# EAGLE design ardusb_zif (EAGLE 6.4)
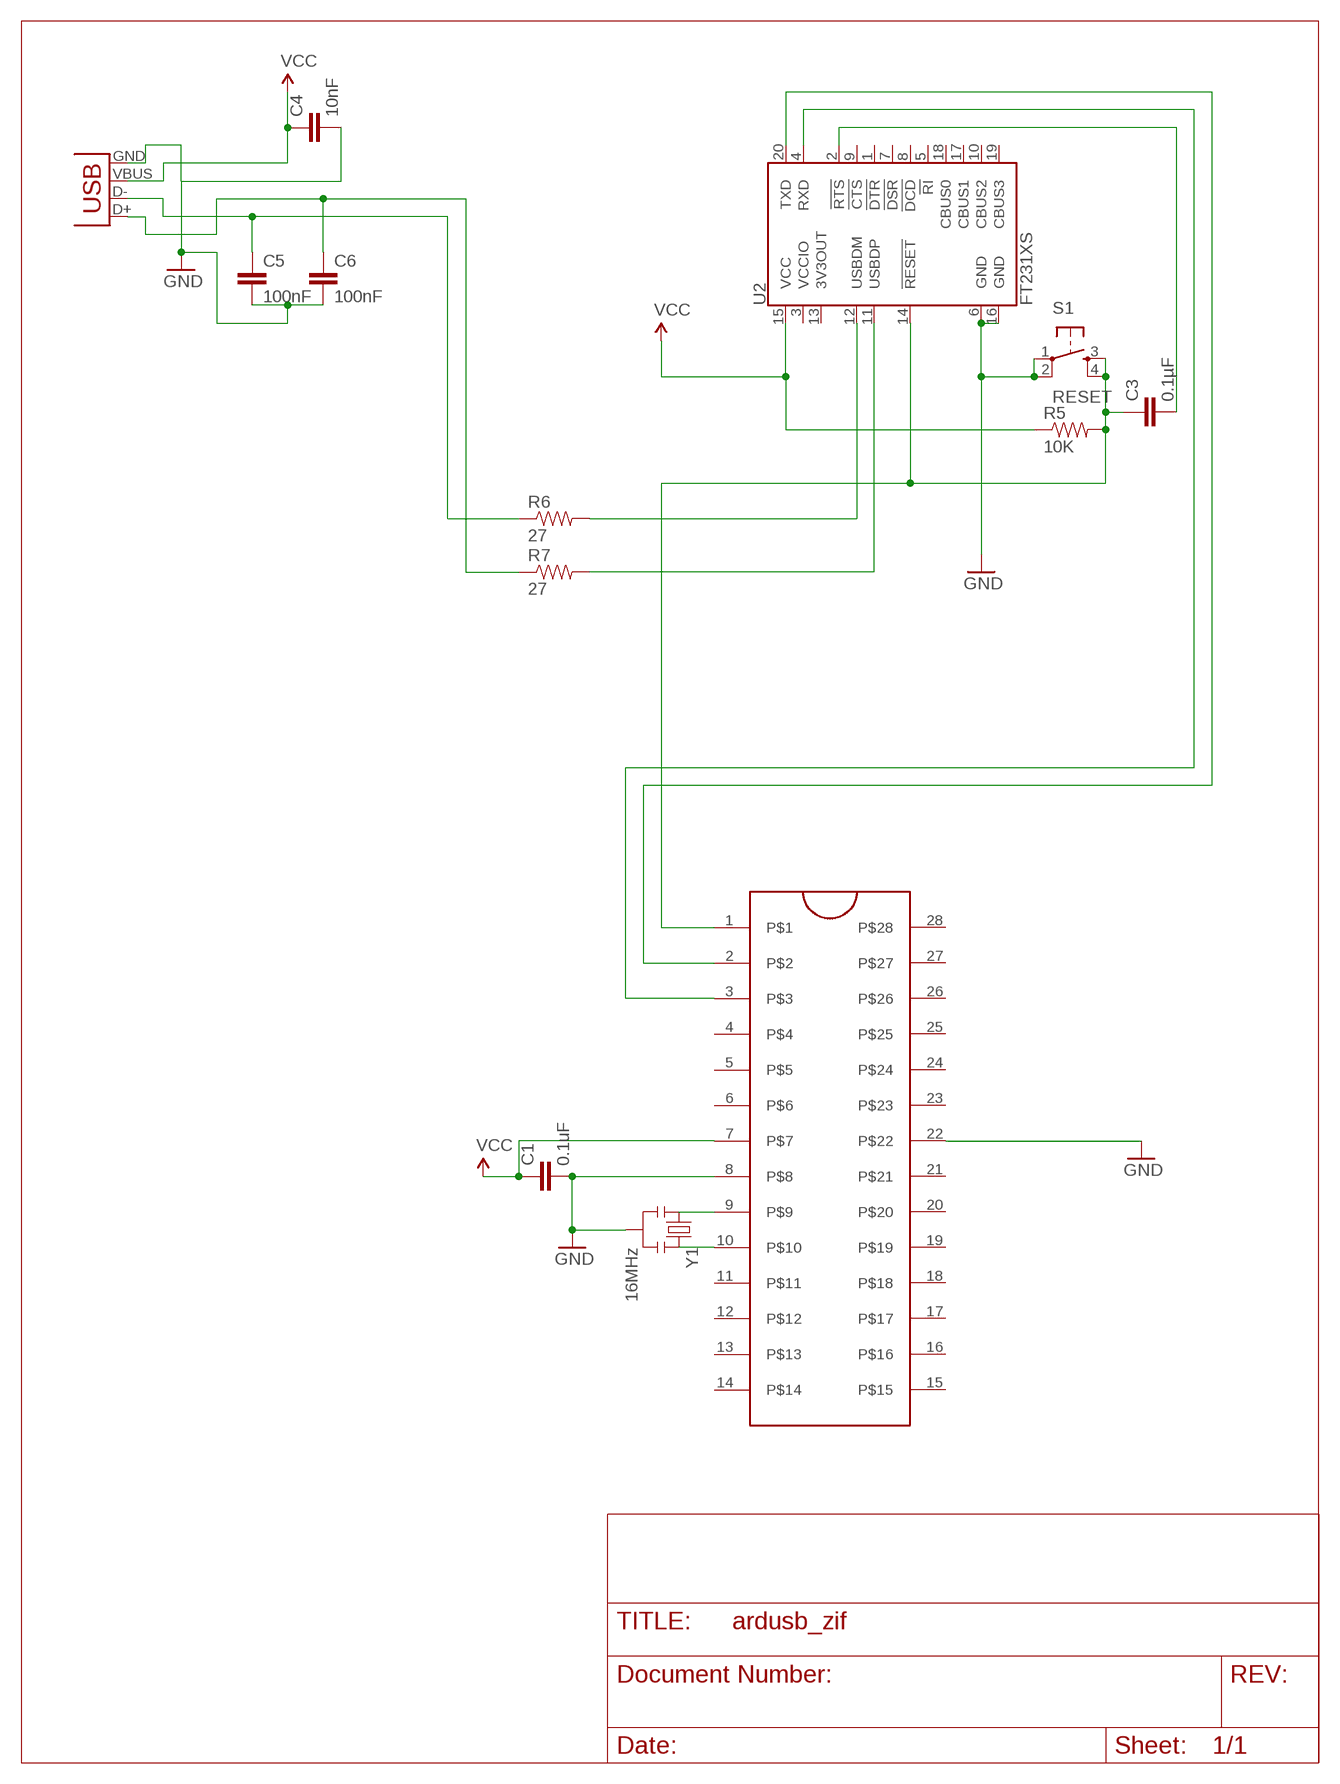
[diagram p0: schematic, sheet 1]

## Parts
C1  0.1uF  CAPPTH  [CAP-PTH-SMALL]
C3  0.1µF  CAPPTH  [CAP-PTH-SMALL]
C4  10nF  CAPPTH  [CAP-PTH-SMALL]
C5  100nF  CAPPTH  [CAP-PTH-SMALL]
C6  100nF  CAPPTH  [CAP-PTH-SMALL]
JP1  USB-B  USBPTH  [USB-B-PTH]
R5  10K  RESISTORPTH-1W  [AXIAL-0.6]
R6  27  RESISTORPTH-1W  [AXIAL-0.6]
R7  27  RESISTORPTH-1W  [AXIAL-0.6]
S1  RESET  TAC_SWITCHPTH  [TACTILE-PTH]
U2  FT231XS  [SSOP20_L]
U$1  ZIFSOCKET-28-3ZIFFSOCKET-28-3  [DIL28-3-ZIF_SOCKET]
Y1  16MHz  RESONATORPTH  [RESONATOR-PTH]

## Nets
GND: C1.2 C4.2 C5.2 C6.2 JP1.GND S1.1 S1.2 U2.6(GND) U2.16(GND) U$1.8 U$1.22 Y1.2
N$1: U$1.9 Y1.1
N$2: U$1.10 Y1.3
N$5: C3.1 R5.P$2 S1.3 S1.4 U2.14(!RESET) U$1.1
N$6: C3.2 U2.2(!RTS)
N$9: R6.P$2 U2.12(USBDM)
N$10: R7.P$2 U2.11(USBDP)
N$11: U2.4(RXD) U$1.3
N$12: U2.20(TXD) U$1.2
N$13: C6.1 JP1.D+ R7.P$1
N$14: C5.1 JP1.D- R6.P$1
VCC: C1.1 C4.1 JP1.VBUS R5.P$1 U2.15(VCC) U$1.7
Unconnected: U2.1(!DTR) U2.3(VCCIO) U2.5(!RI) U2.7(!DSR) U2.8(!DCD) U2.9(!CTS) U2.10(CBUS2) U2.13(3V3OUT) U2.17(CBUS1) U2.18(CBUS0) U2.19(CBUS3) U$1.4 U$1.5 U$1.6 U$1.11 U$1.12 U$1.13 U$1.14 U$1.15 U$1.16 U$1.17 U$1.18 U$1.19 U$1.20 U$1.21 U$1.23 U$1.24 U$1.25 U$1.26 U$1.27 U$1.28

## Library data of the parts
C1 C5 C6 = SparkFun-Capacitors:CAP: Capacitor Standard 0603 ceramic capacitor, and 0.1" leaded capacitor.
C3 C4 = SparkFun-Passives:CAP: Capacitor Standard 0603 ceramic capacitor, and 0.1" leaded capacitor.
JP1 = SparkFun-Connectors:USB: USB Connectors USB-B-PTH is fully proven SKU : PRT-00139/CONN-08278 USB-miniB is fully proven SKU : PRT-00587 USB-A-PCB is untested. USB-A-H is throughly reviewed, but untested. Spark Fun Electronics SKU : PRT-00437 USB-B-SMT is throughly reviewed, but untested. Needs silkscreen touching up. USB-A-S has not been used/tested USB-MB-H has not been used/tested USB-MICROB has been used. CONN-09505; PROD_ID: CONN-08278
R5-R7 = SparkFun-Passives:RESISTOR: Resistor Basic schematic elements and footprints for 0603, 1206, and PTH resistors.
S1 = SparkFun-Electromechanical:TAC_SWITCH: Momentary Switch Button commonly used for reset or general input. Spark Fun Electronics SKU : COM-00097 SMT- SWCH-08247
U2 = SparkFun-DigitalIC:FT231X: FTDI FT231X Full Speed USB to Full-handshake UART This USB2.0 Full Speed IC offers a compact bridge to full handshake UART interfaces. The device is a UART, capable of operating up to 3MBaud, with low power consumption (8mA). The FT231X includes the complete FT-X series feature set and enables USB to be added into a system design quickly and easily over a UART interface.
U$1 = SparkFun-Connectors:ZIFSOCKET-28-3: Lever-action ZIF socket for 28-pin ICs
Y1 = SparkFun-FreqCtrl:RESONATOR: Resonator Small SMD resonator. Used, eg, on the Arduino Pro/ Pro Mini boards. 8MHz- XTAL-08895 16MHz- XTAL-08900

## Board
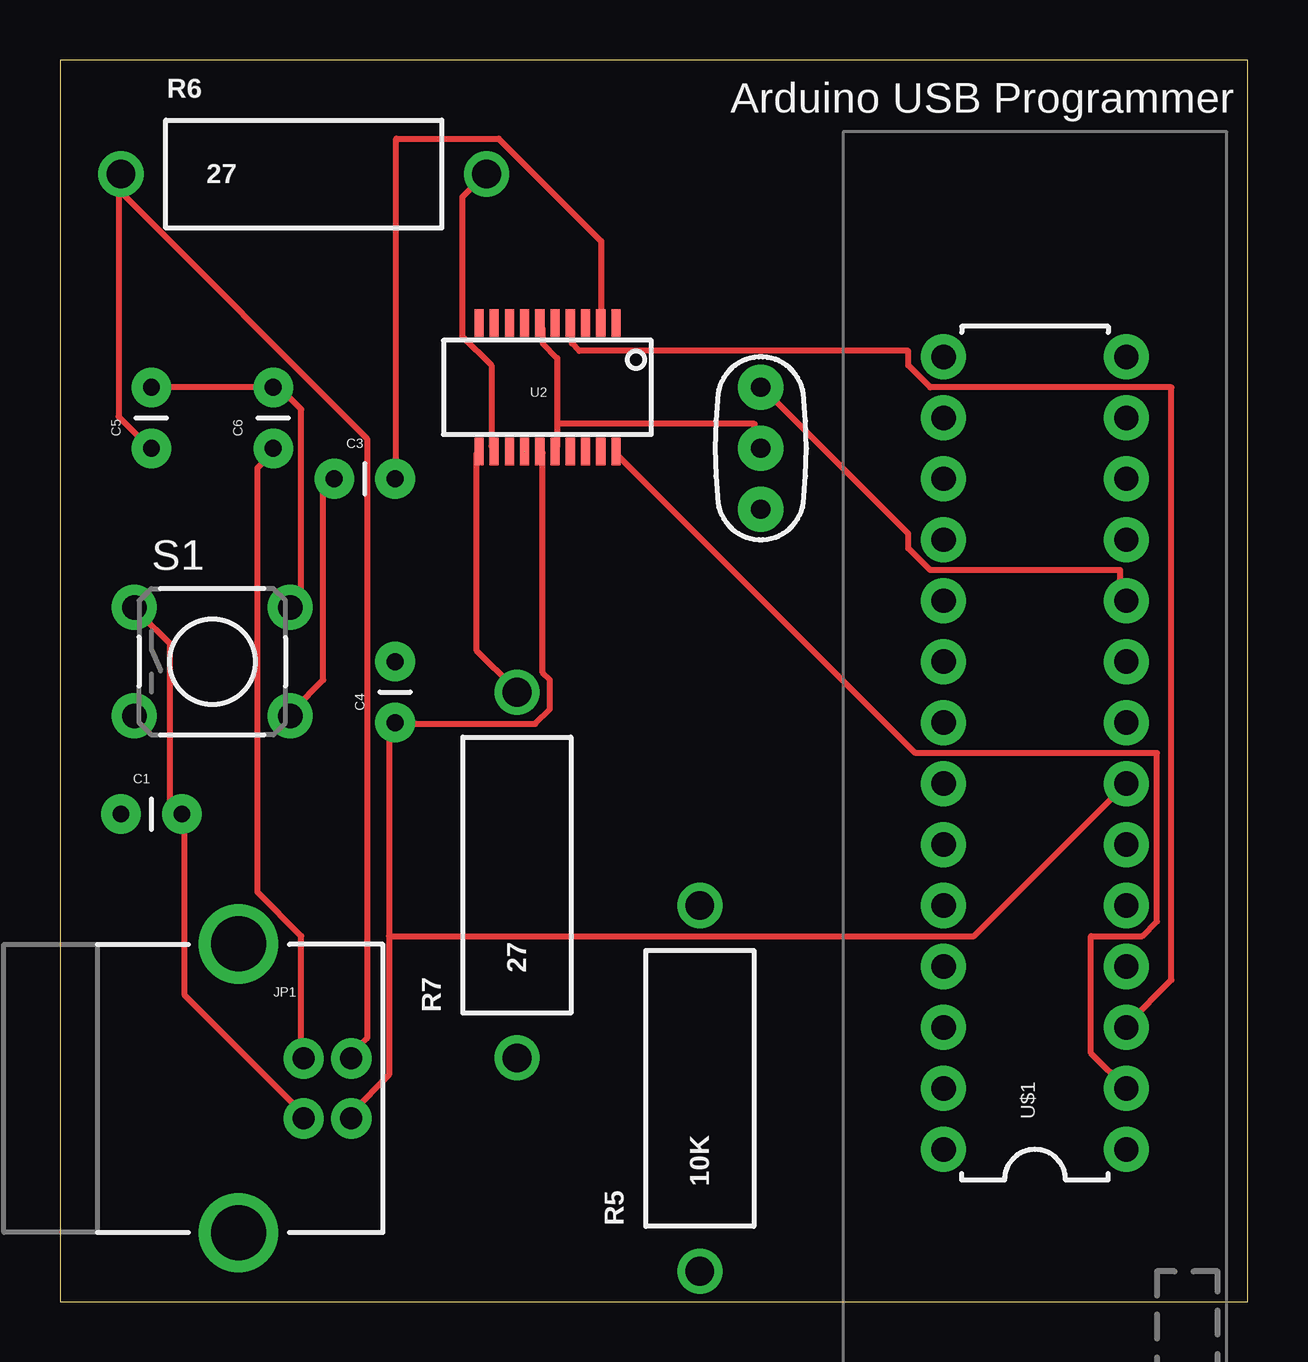
[diagram p1: board, top side]
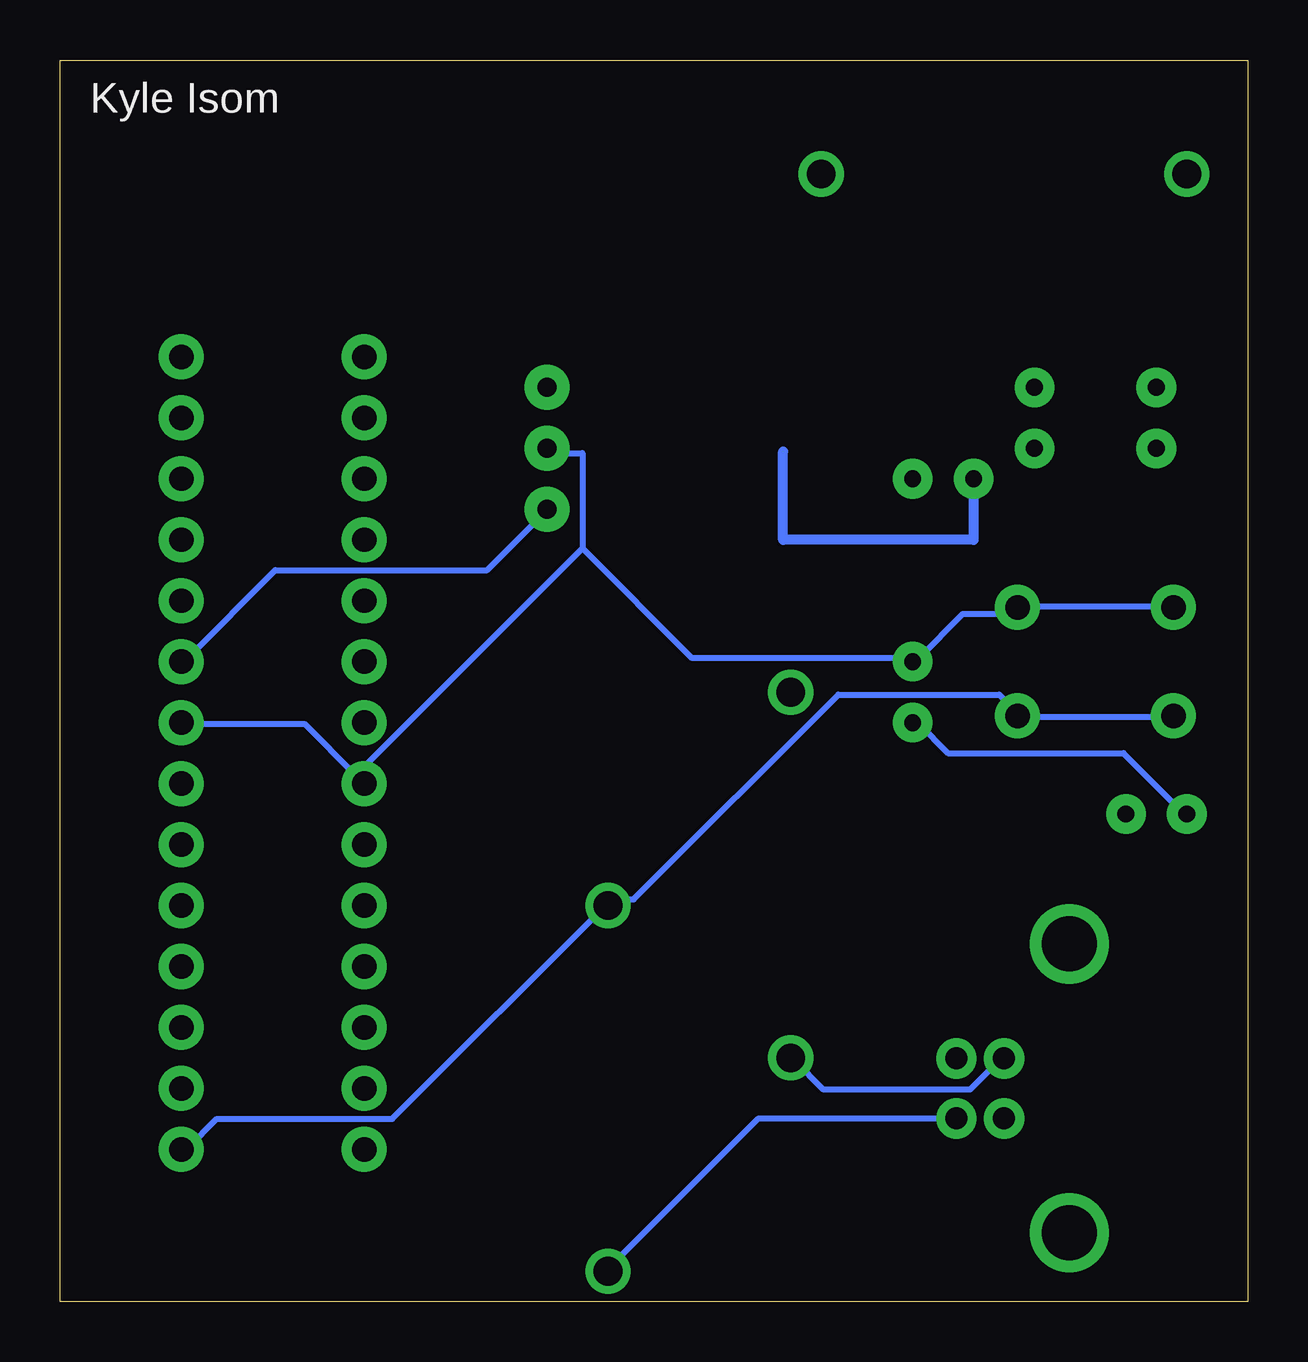
[diagram p2: board, bottom side, seen from below]

Size 49.51 x 51.74 mm. Coordinates in mm from the lower left corner, seen from the top.
Outline: 0,0 49.51,0 49.51,51.74 0,51.74 0,0
Copper layers (1*16): Top 0.035mm / dielectric 1.5mm / Bottom 0.035mm
Design rules "SparkFun": minimum track width 8mil, minimum drill 20mil, track to track 8mil, track to pad 8mil, pad to pad 8mil, via to via 8mil, smd to smd 8mil, copper to edge 10mil, drill to drill 8mil, minimum pad ring 12mil, minimum via ring 10mil, stop-mask expansion 4mil, vias tented up to drill 25mil, thermal gap 10mil

### Footprints (pad centres in the part's own frame; a part is rotated, then mirrored left to right if it is on the bottom)
CAP-PTH-SMALL = drill 0.7 pad 1.651: 1 0,0; 2 2.54,0
USB-B-PTH = drill 0.914 pad 1.676: D+ 0,1.25; D- 1.981,1.25; GND 0,-1.25; VBUS 1.981,-1.25 | drill 2.286: S1 -2.718,-6.02; S2 -2.718,6.02
AXIAL-0.6 = drill 1.2 pad 1.88: P$1 -7.62,0; P$2 7.62,0
TACTILE-PTH = drill 1.016 pad 1.88: 1 -3.251,2.261; 2 3.251,2.261; 3 -3.251,-2.261; 4 3.251,-2.261
SSOP20_L = smd 0.381 x 1.143: 1 -2.857,-2.68; 2 -2.223,-2.68; 3 -1.587,-2.68; 4 -0.953,-2.68; 5 -0.318,-2.68; 6 0.318,-2.68; 7 0.953,-2.68; 8 1.587,-2.68; 9 2.223,-2.68; 10 2.857,-2.68; 11 2.857,2.68; 12 2.223,2.68; 13 1.587,2.68; 14 0.953,2.68; 15 0.318,2.68; 16 -0.318,2.68; 17 -0.953,2.68; 18 -1.587,2.68; 19 -2.223,2.68; 20 -2.857,2.68
DIL28-3-ZIF_SOCKET = drill 1.016 pad 1.88: 1 -16.51,-3.81; 2 -13.97,-3.81; 3 -11.43,-3.81; 4 -8.89,-3.81; 5 -6.35,-3.81; 6 -3.81,-3.81; 7 -1.27,-3.81; 8 1.27,-3.81; 9 3.81,-3.81; 10 6.35,-3.81; 11 8.89,-3.81; 12 11.43,-3.81; 13 13.97,-3.81; 14 16.51,-3.81; 15 16.51,3.81; 16 13.97,3.81; 17 11.43,3.81; 18 8.89,3.81; 19 6.35,3.81; 20 3.81,3.81; 21 1.27,3.81; 22 -1.27,3.81; 23 -3.81,3.81; 24 -6.35,3.81; 25 -8.89,3.81; 26 -11.43,3.81; 27 -13.97,3.81; 28 -16.51,3.81
RESONATOR-PTH = drill 0.8 pad 1.88: 1 -2.54,0; 2 0,0; 3 2.54,0

### Placement (x,y rotation side)
C1  2.54,20.32 0 top
C3  11.43,34.29 0 top
C4  13.97,24.13 90 top
C5  3.81,35.56 90 top
C6  8.89,35.56 90 top
JP1  10.16,8.89 0 top
R5  26.67,8.89 90 top
R6  10.16,46.99 0 top
R7  19.05,17.78 90 top
S1  6.35,26.67 0 top
U2  20.32,38.1 180 top
U$1  40.64,22.86 90 top
Y1  29.21,35.56 90 top

### Tracks (layer width: path | path; a pad name or v marks a point on that pad's centre or on a via)
GND
  Top 0.254: 20.73,36.58 20.73,39.32 20.12,39.93 20.12,40.54 U2.6 | 20.73,36.58 20.73,35.66 U2.16 | 20.73,36.58 28.96,36.58 28.96,35.66 Y1.2 | C5.2 C6.2 9.14,38.1 10.06,37.19 10.06,29.26 9.75,28.96 S1.2 | S1.1 3.35,28.65 4.57,27.43 4.57,20.73 4.88,20.42 C1.2 5.18,20.12 5.18,12.8 10.06,7.92 JP1.GND
  Bottom 0.254: 37.19,21.95 39.32,24.08 44.2,24.08 U$1.8 | 37.19,21.95 U$1.22 36.88,21.64 | 27.74,31.39 37.19,21.95 | 27.74,31.39 27.74,35.36 28.96,35.36 Y1.2 | S1.1 3.35,28.96 9.45,28.96 S1.2 9.75,28.65 11.89,28.65 13.72,26.82 C4.2 14.02,26.82 23.16,26.82 27.74,31.39
N$1
  Bottom 0.254: Y1.1 29.26,32.92 31.7,30.48 40.54,30.48 44.2,26.82 U$1.9
N$2
  Top 0.254: Y1.3 29.26,38.1 35.36,32 35.36,31.39 36.27,30.48 44.2,30.48 44.2,29.26 U$1.10
N$5  (1 unrouted)
  Top 0.254: C3.1 10.97,33.83 10.97,25.91 9.75,24.69 S1.4
  Bottom 0.254: S1.3 3.35,24.38 9.45,24.38 S1.4 9.75,24.69 10.36,25.3 17.07,25.3 25.6,16.76 26.52,16.76 R5.P$2 26.82,16.46 35.66,7.62 42.98,7.62 44.2,6.4 U$1.1
  Bottom 0.406: C3.1 11.43,31.75 19.37,31.75 U2.14
N$6
  Top 0.254: U2.2 22.55,40.84 22.55,44.2 18.29,48.46 14.02,48.46 14.02,34.44 C3.2
N$9
  Top 0.254: U2.12 17.98,35.66 17.98,39.01 16.76,40.23 16.76,46.02 17.68,46.94 R6.P$2
N$10
  Top 0.254: U2.11 17.37,35.36 17.37,27.13 18.9,25.6 R7.P$2
N$11
  Top 0.254: U2.4 21.34,40.54 21.34,39.93 21.64,39.62 35.36,39.62 35.36,39.01 36.27,38.1 46.33,38.1 46.33,13.41 44.5,11.58 U$1.3
N$12
  Top 0.254: U$1.2 42.98,10.36 42.98,15.24 45.11,15.24 45.72,15.85 45.72,22.86 35.66,22.86 23.16,35.36 U2.20
N$13
  Top 0.254: C6.1 8.84,35.36 8.23,34.75 8.23,17.07 10.06,15.24 10.06,10.36 JP1.D+
  Bottom 0.254: R7.P$1 18.9,10.06 17.68,8.84 11.58,8.84 10.36,10.06 JP1.D+
N$14
  Top 0.254: 2.44,46.33 2.44,46.94 R6.P$1 2.44,46.33 | 2.44,46.33 2.44,36.88 3.66,35.66 C5.1 | 2.44,46.33 12.8,35.97 12.8,10.97 12.19,10.36 JP1.D-
VCC
  Top 0.254: U2.15 20.12,35.36 20.12,26.21 20.42,25.91 20.42,24.69 19.81,24.08 14.02,24.08 C4.1 13.72,24.08 13.72,15.24 | 13.72,15.24 13.72,9.45 12.19,7.92 JP1.VBUS | U$1.7 38.1,15.24 13.72,15.24
  Bottom 0.254: C1.1 2.74,20.42 5.18,22.86 12.5,22.86 13.72,24.08 C4.1 | R5.P$1 26.52,1.52 20.42,7.62 12.19,7.62 JP1.VBUS

### Text on the board
tPlace: Arduino USB Programmer
bPlace: Kyle Isom